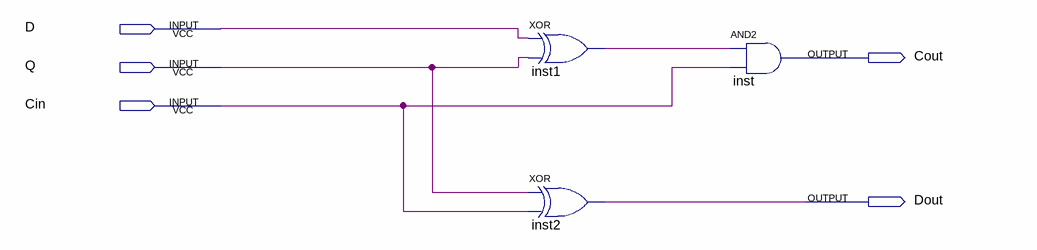
[diagram p0: schematic sheet]
// Quartus schematic HAS.bdf as structural Verilog: 3 symbols, 5 pins
module HAS (
  input  D,
  input  Q,
  input  Cin,
  output Cout,
  output Dout
);

  wire inst1_out;

  xor inst1 (inst1_out, D, Q);
  xor inst2 (Dout, Q, Cin);
  and inst (Cout, inst1_out, Cin);
endmodule
